# Altium schematic sheet micro.SchDoc
size A
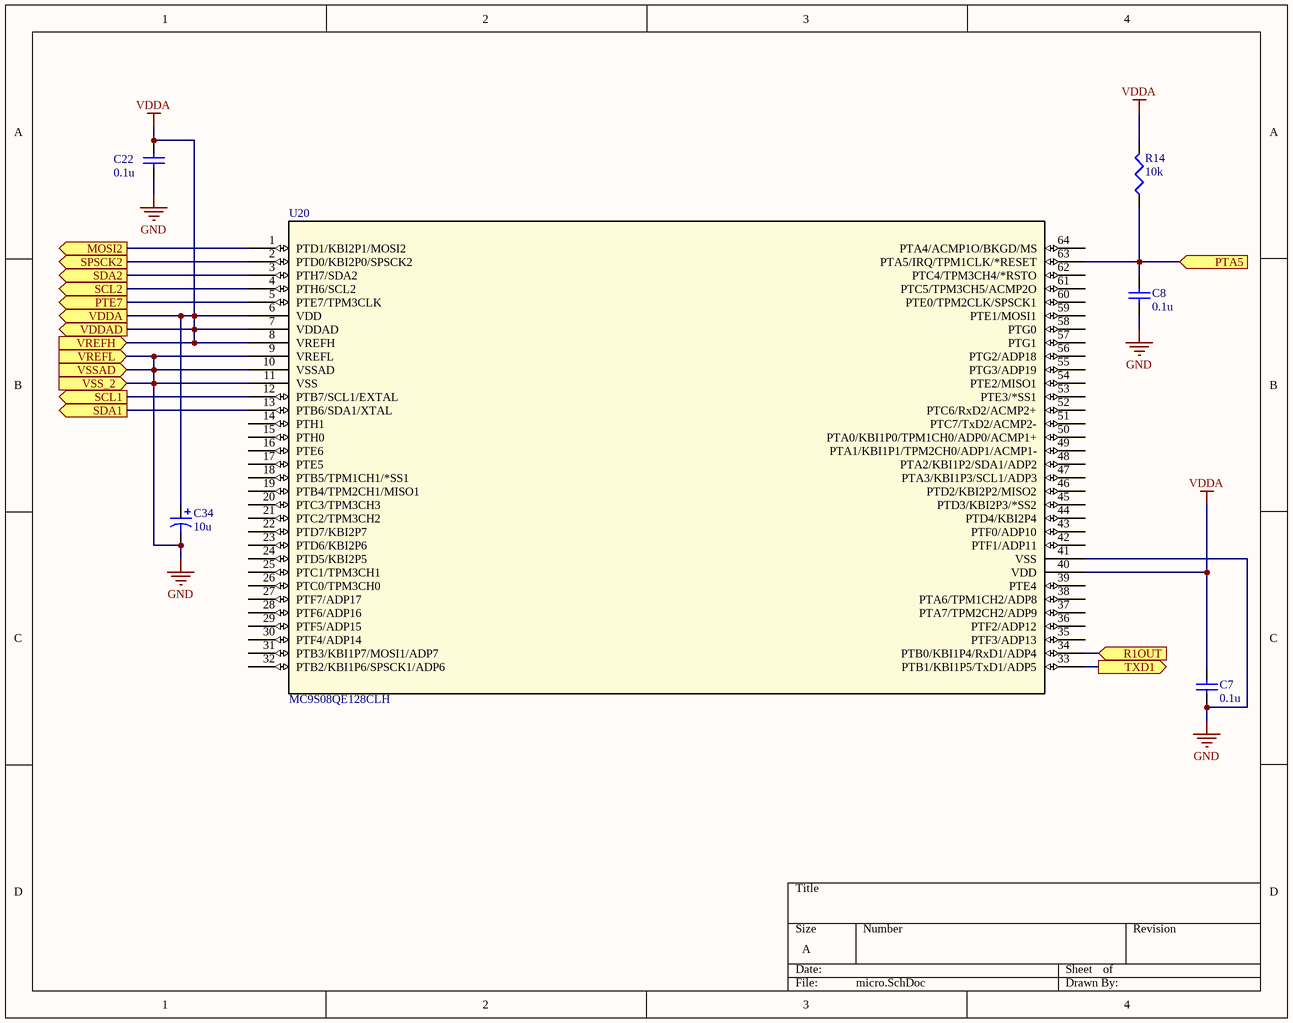
[diagram p0: micro.SchDoc]

## Parts
C7  0.1u  [C1206]
C8  0.1u  [C1206]
C22  0.1u  [C1206]
C34  10u  [C0805]
R14  10k  [J1-0603]
U20  MC9S08QE128CLH  [QFP64_FRE]

## Ports
MOSI2 (out), PTA5 (in), PTE7 (out), R1OUT (in), SCL1 (out), SCL2 (out), SDA1 (out), SDA2 (out), SPSCK2 (out), TXD1 (out), VDDA (out), VDDAD (out), VREFH (in), VREFL (in), VSS_2 (in), VSSAD (in)

## Nets
GND: C7.1 C8.1 C22.1 C34.2 U20.9(VREFL) U20.10(VSSAD) U20.11(VSS) U20.41(VSS) ; port VREFL, port VSSAD, port VSS_2
VDDA: C7.2 C22.2 C34.1 R14.2 U20.6(VDD) U20.7(VDDAD) U20.8(VREFH) U20.40(VDD) ; port VDDA, port VDDAD, port VREFH
MOSI2: U20.1(PTD1/KBI2P1/MOSI2) ; port MOSI2
PTA5: C8.2 R14.1 U20.63(PTA5/IRQ/TPM1CLK/*RESET) ; port PTA5
PTE7: U20.5(PTE7/TPM3CLK) ; port PTE7
R1OUT: U20.34(PTB0/KBI1P4/RxD1/ADP4) ; port R1OUT
SCL1: U20.12(PTB7/SCL1/EXTAL) ; port SCL1
SCL2: U20.4(PTH6/SCL2) ; port SCL2
SDA1: U20.13(PTB6/SDA1/XTAL) ; port SDA1
SDA2: U20.3(PTH7/SDA2) ; port SDA2
SPSCK2: U20.2(PTD0/KBI2P0/SPSCK2) ; port SPSCK2
TXD1: U20.33(PTB1/KBI1P5/TxD1/ADP5) ; port TXD1

Not connected (* = marked no-connect by the designer): U20 14(PTH1) 15(PTH0) 16(PTE6) 17(PTE5) 18(PTB5/TPM1CH1/*SS1) 19(PTB4/TPM2CH1/MISO1) 20(PTC3/TPM3CH3) 21(PTC2/TPM3CH2) 22(PTD7/KBI2P7) 23(PTD6/KBI2P6) 24(PTD5/KBI2P5) 25(PTC1/TPM3CH1) 26(PTC0/TPM3CH0) 27(PTF7/ADP17) 28(PTF6/ADP16) 29(PTF5/ADP15) 30(PTF4/ADP14) 31(PTB3/KBI1P7/MOSI1/ADP7) 32(PTB2/KBI1P6/SPSCK1/ADP6) 35(PTF3/ADP13) 36(PTF2/ADP12) 37(PTA7/TPM2CH2/ADP9) 38(PTA6/TPM1CH2/ADP8) 39(PTE4) 42(PTF1/ADP11) 43(PTF0/ADP10) 44(PTD4/KBI2P4) 45(PTD3/KBI2P3/*SS2) 46(PTD2/KBI2P2/MISO2) 47(PTA3/KBI1P3/SCL1/ADP3) 48(PTA2/KBI1P2/SDA1/ADP2) 49(PTA1/KBI1P1/TPM2CH0/ADP1/ACMP1-) 50(PTA0/KBI1P0/TPM1CH0/ADP0/ACMP1+) 51(PTC7/TxD2/ACMP2-) 52(PTC6/RxD2/ACMP2+) 53(PTE3/*SS1) 54(PTE2/MISO1) 55(PTG3/ADP19) 56(PTG2/ADP18) 57(PTG1) 58(PTG0) 59(PTE1/MOSI1) 60(PTE0/TPM2CLK/SPSCK1) 61(PTC5/TPM3CH5/ACMP2O) 62(PTC4/TPM3CH4/*RSTO) 64(PTA4/ACMP1O/BKGD/MS)

## Library data of the parts
C7 C8 C22 = Cap Semi: Capacitor (Semiconductor SIM Model); Value: 100pF; Published: 8-Jun-2000; LatestRevisionDate: 29-May-2009; LatestRevisionNote: IPC-7351 Footprint Added.; PackageReference: C1206; Publisher: Altium Limited; PackageDescription: Chip Capacitor
C34 = Cap Pol3: Polarized Capacitor (Surface Mount); Value: 100pF; Published: 8-Jun-2000; LatestRevisionDate: 29-May-2009; LatestRevisionNote: IPC-7351 Footprint Added.; PackageReference: C0805; Publisher: Altium Limited; PackageDescription: Chip Capacitor
R14 = Res3: Resistor; Value: 1K; Published: 8-Jun-2000; LatestRevisionDate: 29-May-2009; LatestRevisionNote: IPC-7351 Footprint Added.; PackageReference: J1-0603; Publisher: Altium Limited; PackageDescription: Chip Resistor
U20 = MC9S08QE128CLH: No Description Available; Mfr_Name: NXP; Copyright: Copyright (C) 2022 Ultra Librarian. All rights reserved.; Manufacturer_Part_Number: MC9S08QE128CLH; Digi-Key_Part_Number_1: MC9S08QE128CLH-ND; RefDes: RefDes; Type: DEV